# EasyEDA Pro project 大疆分电板（xt60 gh1.25）.epro

# Schematic Schematic1
Board Name: Board1; Create Date: 2024-05-03; Page Name: P1; Project Name: 大疆分电板（can_1.25 xt60）; Schematic Name: Schematic1; Update Date: 2024-05-03; Company: 嘉立创EDA; Page Size: A4; Version: V1.0
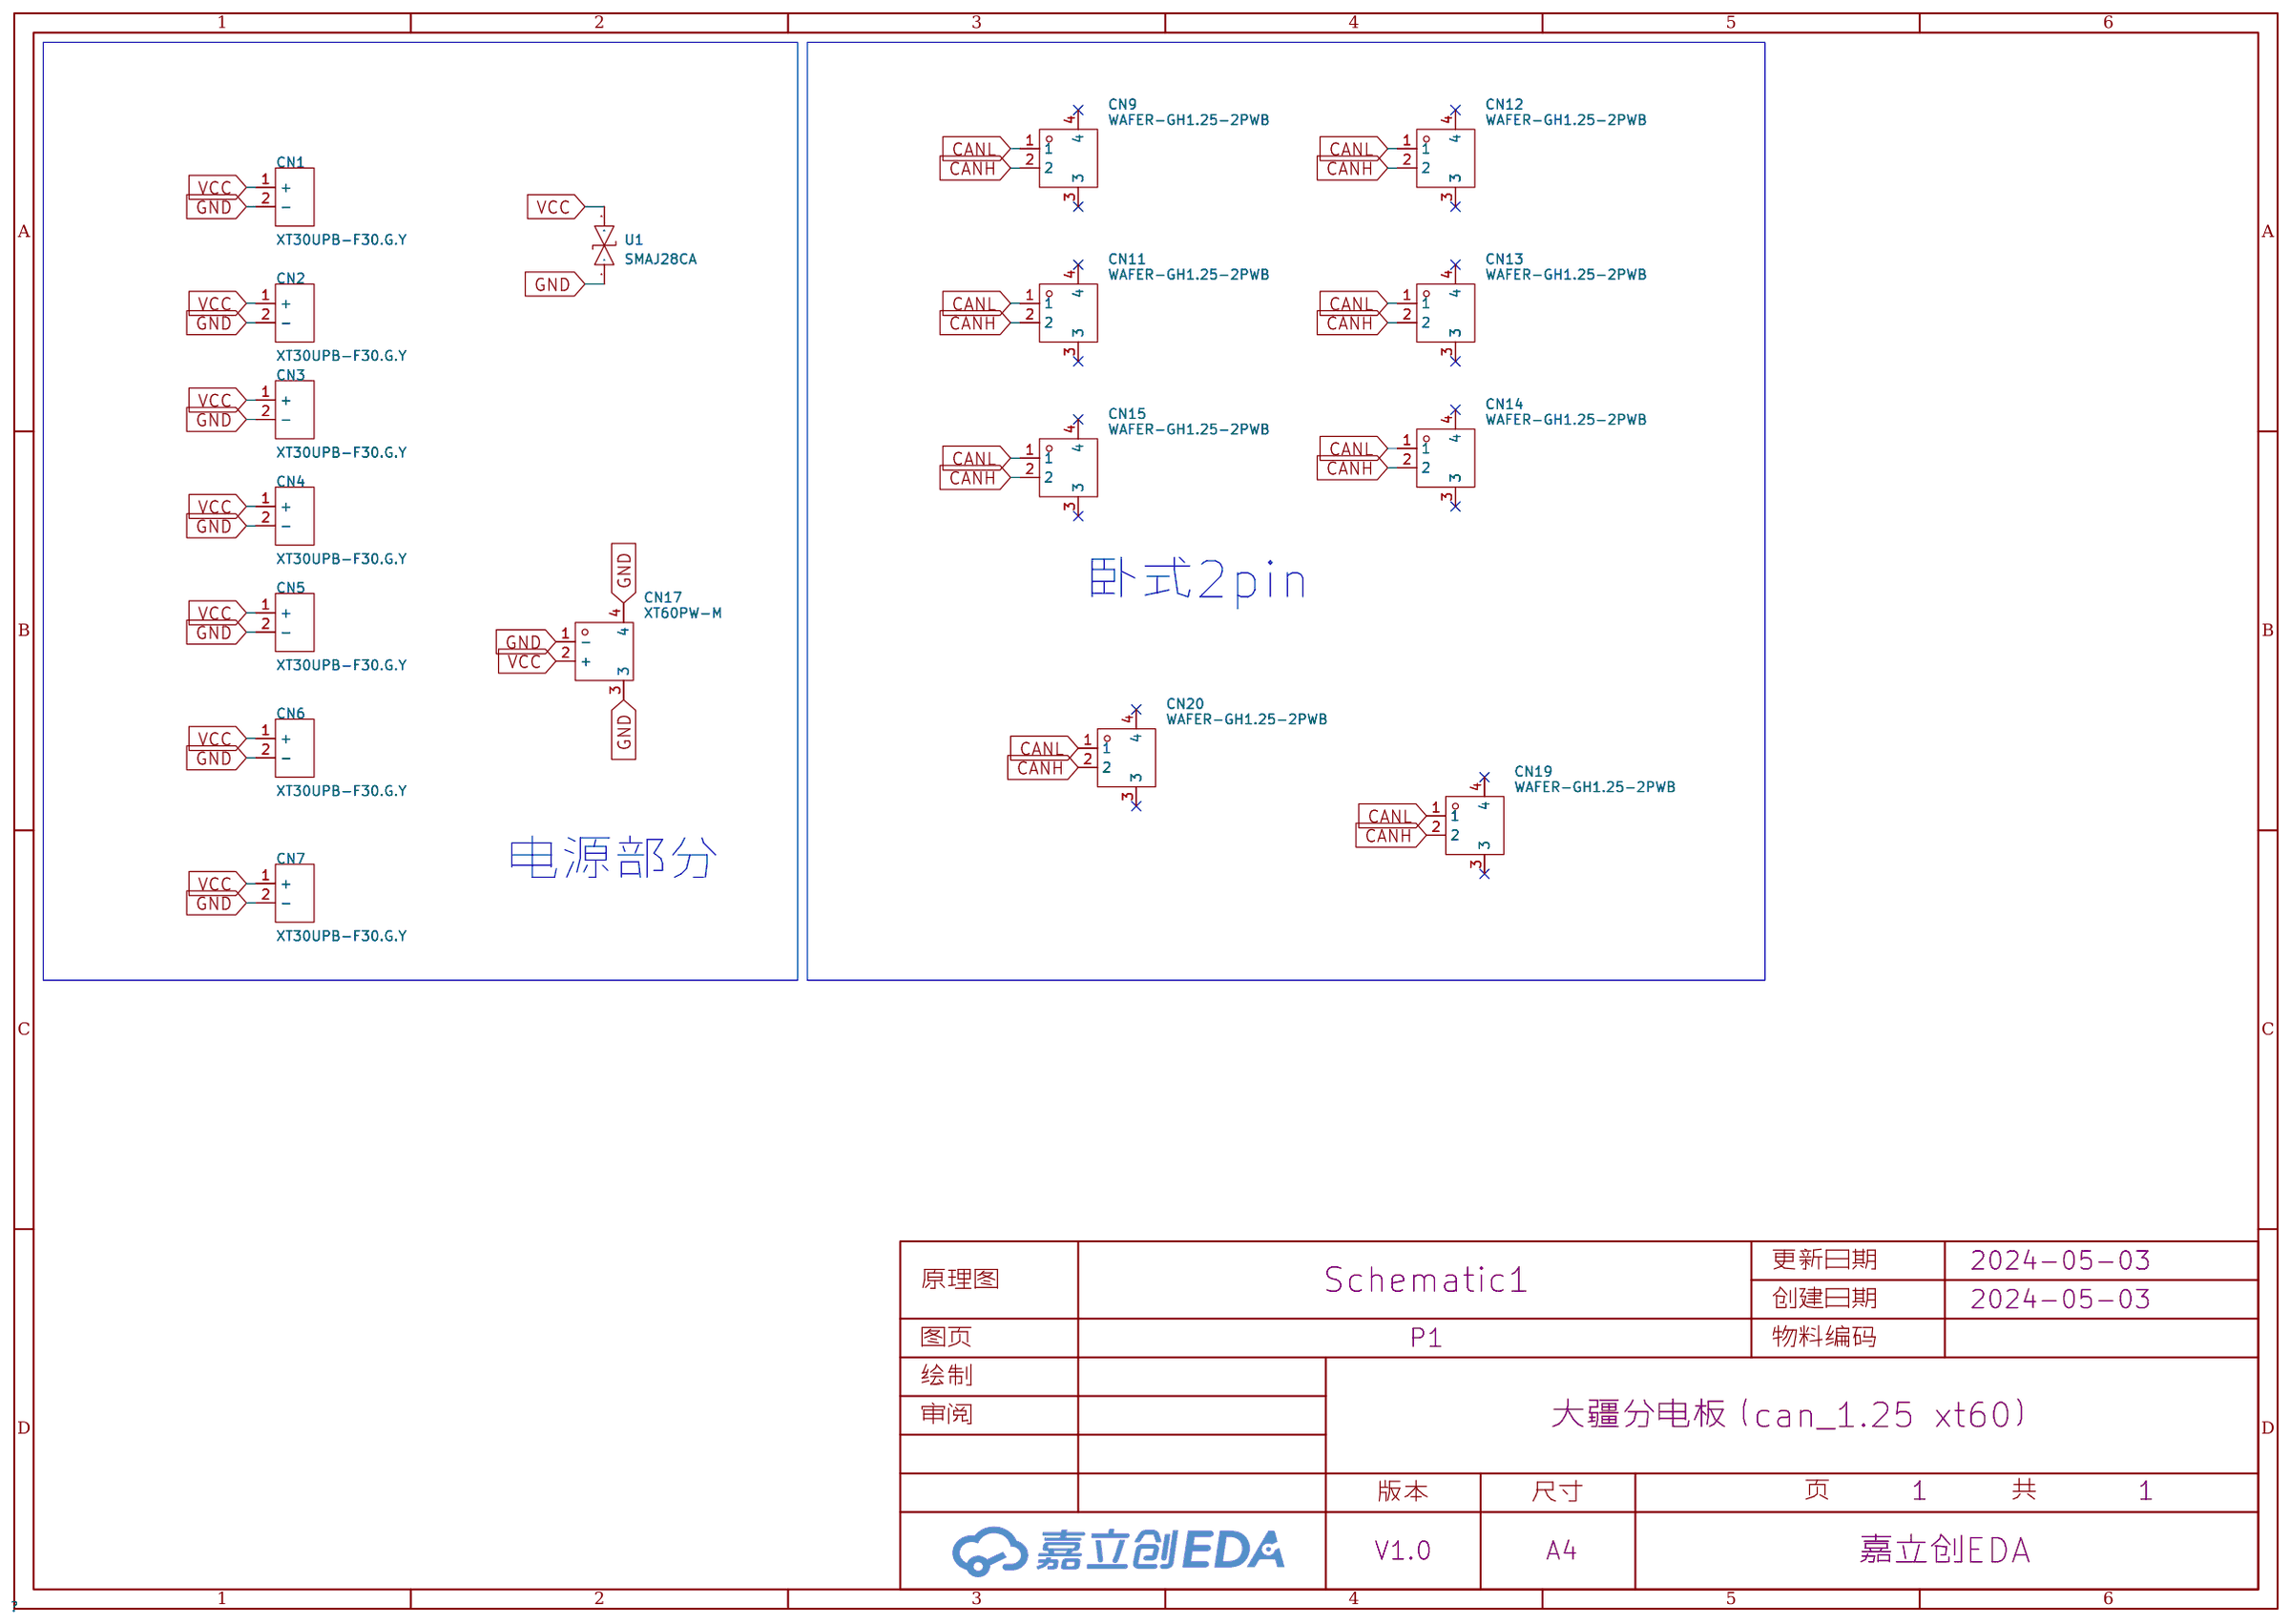
[diagram p0: schematic sheet]

## Parts
CN1  XT30UPB-F30.G.Y  [CONN-TH_XT30UPB-F]
CN2  XT30UPB-F30.G.Y  [CONN-TH_XT30UPB-F]
CN3  XT30UPB-F30.G.Y  [CONN-TH_XT30UPB-F]
CN4  XT30UPB-F30.G.Y  [CONN-TH_XT30UPB-F]
CN5  XT30UPB-F30.G.Y  [CONN-TH_XT30UPB-F]
CN6  XT30UPB-F30.G.Y  [CONN-TH_XT30UPB-F]
CN7  XT30UPB-F30.G.Y  [CONN-TH_XT30UPB-F]
CN9  WAFER-GH1.25-2PWB  [CONN-TH_2P-P1.25_XUNPU_WAFER-GH1.25-2PWB]
CN11  WAFER-GH1.25-2PWB  [CONN-TH_2P-P1.25_XUNPU_WAFER-GH1.25-2PWB]
CN12  WAFER-GH1.25-2PWB  [CONN-TH_2P-P1.25_XUNPU_WAFER-GH1.25-2PWB]
CN13  WAFER-GH1.25-2PWB  [CONN-TH_2P-P1.25_XUNPU_WAFER-GH1.25-2PWB]
CN14  WAFER-GH1.25-2PWB  [CONN-TH_2P-P1.25_XUNPU_WAFER-GH1.25-2PWB]
CN15  WAFER-GH1.25-2PWB  [CONN-TH_2P-P1.25_XUNPU_WAFER-GH1.25-2PWB]
CN17  XT60PW-M  [CONN-TH_XT60PW-M]
CN19  WAFER-GH1.25-2PWB  [CONN-TH_2P-P1.25_XUNPU_WAFER-GH1.25-2PWB]
CN20  WAFER-GH1.25-2PWB  [CONN-TH_2P-P1.25_XUNPU_WAFER-GH1.25-2PWB]
U1  SMAJ28CA  [SMA_L4.3-W2.7-LS5.0-BI]

## Library data of the parts
CN1-CN7 = XT30UPB-F30.G.Y: 类别:-;类型1:-;; LCSC Part Name: AMASS(艾迈斯)直立焊板式连接器XT30UPB30-F.G.*; Supplier Part: C108769; Manufacturer: AMASS(艾迈斯); JLCPCB Part Class: Extended Part; Datasheet: https://atta.szlcsc.com/upload/public/pdf/source/20220715/AFD68B9E8B6CA95A7295DBF4AF9325E4.pdf; Supplier: LCSC; Brand: 艾迈斯; Type: 航模插头; Colour: 黄色; RatedVoltage: DC 500V; InterfaceType: 母头; MetalMaterial: 镀金; InsulationMaterial: PA; RatedCurrent: 15A; contact resistance: 0.65mΩ
CN9 CN11-CN15 CN19 CN20 = WAFER-GH1.25-2PWB: 插针结构:1x2P;间距:1.25mm;安装方式:卧贴;参考系列:GH;总PIN数:2P;排数:1;每排PIN数:2;额定电流:1A;工作温度范围:-25℃~+85℃;; LCSC Part Name: 1x2P 间距:1.25mm 卧贴 系列:GH; Supplier Part: C3029377; Manufacturer: XUNPU(讯普); Supplier Footprint: SMD,P=1.25mm,卧贴; JLCPCB Part Class: Extended Part; Datasheet: https://atta.szlcsc.com/upload/public/pdf/source/20220527/CB8773BFB0913C3B8ABD62CB38BA101A.pdf; Supplier: LCSC; Pins Structure: 1x2P; Pitch: 1.25mm; Mounting Style: 卧贴; Reference Series: GH; Number of Pins: 2P; Number of Rows: 1; Number of PINs Per Row: 2; Current Rating (Max): 1A; Operating Temperature Range: -25℃~+85℃
CN17 = XT60PW-M: 类别:-;类型1:-;; LCSC Part Name: AMASS(艾迈斯)航模插头xt60连接器150公母对接pw锂电池公头 板插卧式XT60PW-M; Supplier Part: C98732; Manufacturer: AMASS(艾迈斯); JLCPCB Part Class: 扩展库; Datasheet: https://atta.szlcsc.com/upload/public/pdf/source/20240118/44A3DCFF53BE25DC65378AFFB21277A4.pdf; Supplier: LCSC; Brand: 艾迈斯; Type: 卧式插头; Colour: 黄色; InterfaceType: 公头
U1 = SMAJ28CA_C908827: 反向截止电压(Vrwm):28V;最大钳位电压:45.4V;峰值脉冲电流(Ipp)@10/1000us:8.8A;击穿电压:31.1V;; LCSC Part Name: 双向TVS 28V截止 8.8A峰值脉冲; Supplier Part: C908827; Manufacturer: GOODWORK(固得沃克); Supplier Footprint: SMA(DO-214AC); JLCPCB Part Class: Extended Part; Datasheet: https://atta.szlcsc.com/upload/public/pdf/source/20201231/C908757_5436EAF671B686EFC2F0DD2098F0ED89.pdf; Supplier: LCSC; Reverse Stand-Off Voltage (Vrwm): 28V; Maximum Clamping Voltage: 45.4V; Peak Pulse Current (Ipp)@10/1000us: 8.8A; Breakdown Voltage: 31.1V; Reverse Leakage Current (Ir): 5uA; Type: TVS

## Nets
GND: CN1.2(-) CN2.2(-) CN3.2(-) CN4.2(-) CN5.2(-) CN6.2(-) CN7.2(-) CN17.1(-) CN17.3 CN17.4 U1.1
VCC: CN1.1(+) CN2.1(+) CN3.1(+) CN4.1(+) CN5.1(+) CN6.1(+) CN7.1(+) CN17.2(+) U1.2
CANH: CN9.2 CN11.2 CN12.2 CN13.2 CN14.2 CN15.2 CN19.2 CN20.2
CANL: CN9.1 CN11.1 CN12.1 CN13.1 CN14.1 CN15.1 CN19.1 CN20.1

Not connected (* = marked no-connect by the designer): CN9 3* 4*; CN11 3* 4*; CN12 3* 4*; CN13 3* 4*; CN14 3* 4*; CN15 3* 4*; CN19 3* 4*; CN20 3* 4*

## Notes on the sheet
- 卧式2pin
- 电源部分

# Board PCB1
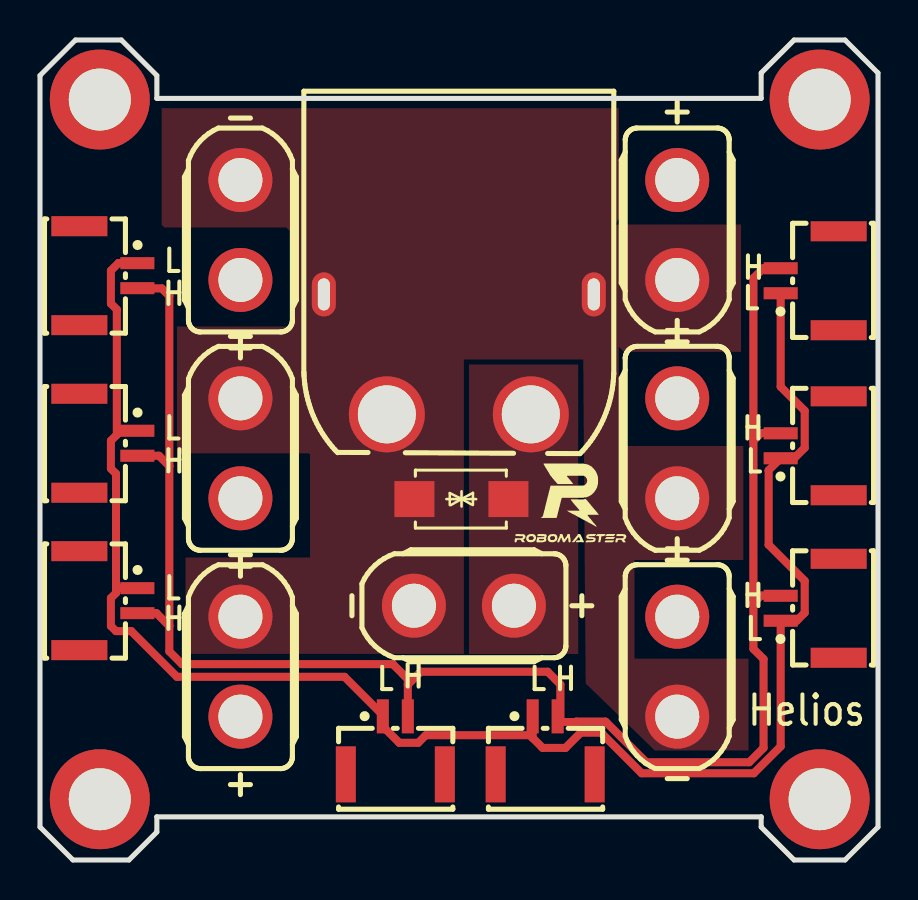
[diagram p1: board, top side]
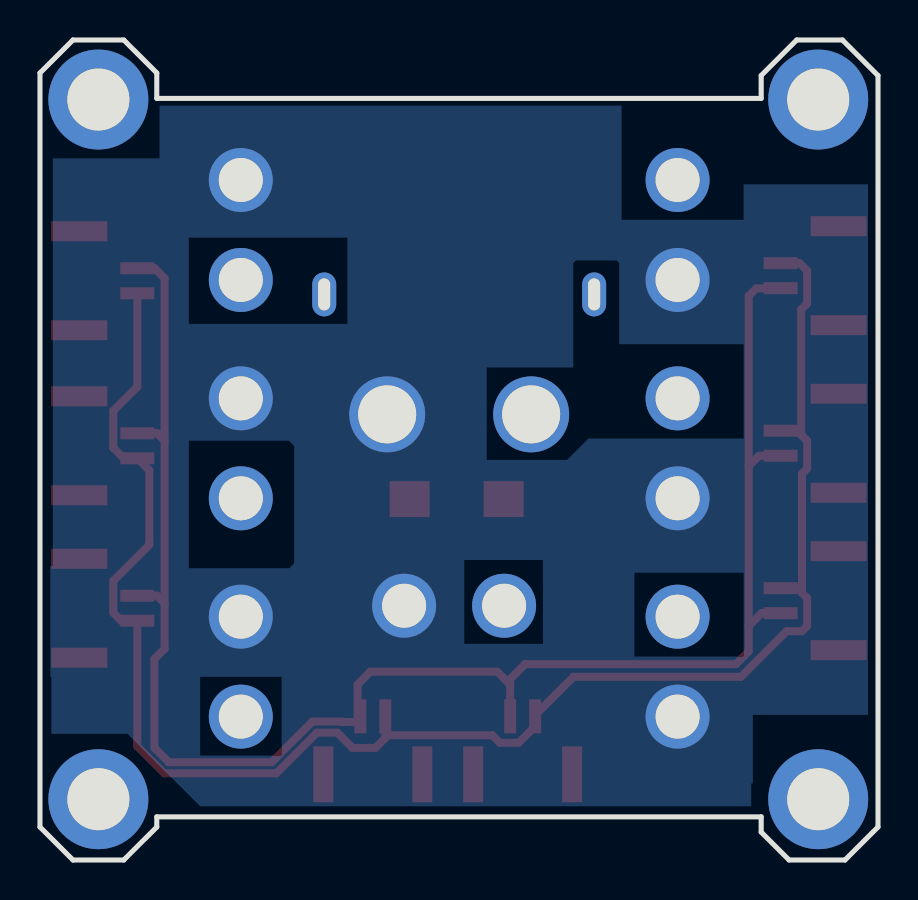
[diagram p2: board, bottom side, seen from below]

Outline 41.91 x 41.02 mm; copper layers: Top Layer, Bottom Layer. Coordinates in mm from the lower left corner of the outline.
Outline path: 0,39.24 1.78,41.02 4.06,41.02 5.84,39.24 5.84,38.1 36.07,38.1 36.07,39.37 37.72,41.02 40.26,41.02 41.91,39.37 41.91,1.65 40.26,0 37.72,0 36.07,1.65 36.07,2.16 5.84,2.16 5.84,1.4 4.45,0 1.65,0 0,1.65 0,39.24
Stack: Top Layer 0.035mm / Dielectric1 1.51mm FR4 er 4.5 / Bottom Layer 0.035mm

## Design rules (mm)
net CANH: DP1
net CANL: DP1
template: JLCPCB Capability(Two Layers Board)
spacing copperThickness1oz (default): track to track 0.102, other pairs 0.152 to 0.3
spacing copperThickness2oz: track to track 0.203, other pairs 0.152 to 0.3
track width copperThickness1oz (default): min 0.127, default 0.254, max 2.54
track width copperThickness2oz: min 0.203, default 0.254, max 2.54
differential pair differentialPair (default): width min 0.127, default 0.254, max 2.54; gap min 0.152, default 0.152
via viaSize (default): diameter min 0.5, default 0.61, max 10; hole min 0.3, default 0.305, max 6.3

## Placement (name value [footprint] x y rotation side)
CN1  XT30UPB-F30.G.Y  [CONN-TH_XT30UPB-F]  10.02 31.52 90 top
CN2  XT30UPB-F30.G.Y  [CONN-TH_XT30UPB-F]  10.02 20.59 90 top
CN3  XT30UPB-F30.G.Y  [CONN-TH_XT30UPB-F]  10.02 9.67 90 top
CN4  XT30UPB-F30.G.Y  [CONN-TH_XT30UPB-F]  31.87 31.52 270 top
CN5  XT30UPB-F30.G.Y  [CONN-TH_XT30UPB-F]  31.87 20.59 270 top
CN6  XT30UPB-F30.G.Y  [CONN-TH_XT30UPB-F]  31.87 9.67 270 top
CN7  XT30UPB-F30.G.Y  [CONN-TH_XT30UPB-F]  21.2 12.72 180 top
CN9  WAFER-GH1.25-2PWB  [CONN-TH_2P-P1.25_XUNPU_WAFER-GH1.25-2PWB]  38.49 28.98 90 top
CN11  WAFER-GH1.25-2PWB  [CONN-TH_2P-P1.25_XUNPU_WAFER-GH1.25-2PWB]  3.42 29.23 270 top
CN12  WAFER-GH1.25-2PWB  [CONN-TH_2P-P1.25_XUNPU_WAFER-GH1.25-2PWB]  38.49 20.72 90 top
CN13  WAFER-GH1.25-2PWB  [CONN-TH_2P-P1.25_XUNPU_WAFER-GH1.25-2PWB]  38.49 12.59 90 top
CN14  WAFER-GH1.25-2PWB  [CONN-TH_2P-P1.25_XUNPU_WAFER-GH1.25-2PWB]  3.42 12.97 270 top
CN15  WAFER-GH1.25-2PWB  [CONN-TH_2P-P1.25_XUNPU_WAFER-GH1.25-2PWB]  3.42 20.85 270 top
CN17  XT60PW-M  [CONN-TH_XT60PW-M]  20.95 25.29 270 top
CN19  WAFER-GH1.25-2PWB  [CONN-TH_2P-P1.25_XUNPU_WAFER-GH1.25-2PWB]  17.77 5.74 0 top
CN20  WAFER-GH1.25-2PWB  [CONN-TH_2P-P1.25_XUNPU_WAFER-GH1.25-2PWB]  25.26 5.74 0 top
NOREF  -  [Pad_e36]  38.99 3.04 0 top
NOREF#2  -  [Pad_e34]  38.99 38.04 0 top
NOREF#3  -  [Pad_e31]  2.99 38.04 0 top
NOREF#4  -  [Pad_e35]  2.99 3.04 0 top
U1  SMAJ28CA  [SMA_L4.3-W2.7-LS5.0-BI]  21.07 18.05 0 top

## Footprints (pads in the part's own frame, mm; a bottom-side part is the same pattern mirrored in y, then rotated)
CONN-TH_2P-P1.25_XUNPU_WAFER-GH1.25-2PWB
  rect 0.6x1.7 smd: 1(-0.625,1.45) 2(0.625,1.45)
  rect 1x2.8 smd: 3(-2.475,-1.45) 4(2.475,-1.45)
CONN-TH_XT30UPB-F
  round 3.2 hole 2.2: 1(-2.5,0) 2(2.5,0)
CONN-TH_XT60PW-M
  round 3.8 hole 2.9: 1(3,-3.6) 2(3,3.6)
  oval 2.2x1.2 hole 1.6x0.6: 3(-3,6.75) 4(-3,-6.75)
Pad_e31
  round 5 hole 3.1: 7(0,0)
Pad_e34
  round 5 hole 3.1: 7(0,0)
Pad_e35
  round 5 hole 3.1: 7(0,0)
Pad_e36
  round 5 hole 3.1: 7(0,0)
SMA_L4.3-W2.7-LS5.0-BI
  rect 2x1.8 smd: 1(-2.35,0) 2(2.35,0)

## Nets
As in the schematic.

Pads without a net: CN9 3 4; CN11 3 4; CN12 3 4; CN13 3 4; CN14 3 4; CN15 3 4; CN19 3 4; CN20 3 4; NOREF 7; NOREF#2 7; NOREF#3 7; NOREF#4 7

## Routing (per net, layer and track width the routed paths; a pad name or vN(x,y) marks a point on that pad's centre or on a via; arc(x,y) is an arc through that point)
CANH: length 87.2
  Top Layer w0.4: 18.4,8.77 19.04,9.42 25.39,9.42 26.03,8.78 26.03,6.91 26.04,6.9 26.79,6.9 26.81,6.92 28.29,6.92 30.32,4.89 35.47,4.89 36.19,5.61 36.19,10.05 35.68,10.56 35.68,12.85 ; 18.4,8.77 18.4,9.05 17.64,9.8 7.1,9.8 6.47,10.43 6.47,11.7 ; 18.4,8.77 18.4,7.28 ; 35.68,12.85 35.68,20.98 ; 35.68,12.85 36.06,13.23 37.03,13.23 CN13.2 ; 35.68,20.98 35.68,29.1 36.19,29.61 37.03,29.61 CN9.2 ; 35.68,20.98 36.06,21.36 37.03,21.36 CN12.2 ; 6.47,19.71 5.95,20.22 CN15.2 ; 6.47,19.71 6.47,11.7 ; 6.47,19.71 6.47,28.21 6.09,28.6 4.88,28.6 CN11.2 ; 6.47,11.7 5.82,12.35 CN14.2
CANL: length 87.4
  Top Layer w0.4: 3.8,13.61 3.8,13.36 3.55,13.1 3.55,11.7 3.8,11.45 4.56,11.45 6.85,9.16 15.23,9.16 17.15,7.25 17.15,6.68 17.97,5.86 18.91,5.86 19.29,6.24 24.5,6.24 24.64,6.11 ; 3.8,13.61 3.8,19.32 3.55,19.58 3.55,20.98 3.84,21.27 ; 3.8,13.61 3.81,13.6 CN14.1 ; CN20.1 24.64,6.11 ; 24.64,6.11 25.14,5.61 26.28,5.61 27.04,6.37 28.06,6.37 30.09,4.34 35.7,4.34 37.04,5.68 CN13.1 37.84,11.97 38.24,12.37 38.24,13.96 36.44,15.77 36.44,19.49 CN12.1 37.72,20.1 38.24,20.62 38.24,22.47 37.04,23.67 CN9.1 ; 3.84,21.27 4.04,21.47 CN15.1 ; 3.84,21.27 3.84,27.54 3.55,27.83 3.55,29.48 3.93,29.87 4.86,29.87 CN11.1

## Copper pours and planes (outline as drawn; the poured copper is in the pictures)
GND on Top Layer: 6.09,37.61 35.43,37.61 35.43,5.48 6.09,5.48
VCC on Top Layer: 21.45,24.79 26.91,24.79 26.91,10.31 21.45,10.31
VCC on Bottom Layer: 34.47,35.1 41.27,35.1 41.27,12.97 34.47,12.97
VCC on Bottom Layer: 6.34,10.82 41.34,10.82 41.34,2.69 6.34,2.69
VCC on Bottom Layer: 0.66,37.74 41.39,37.74 41.39,3.83 0.66,3.83
VCC on Bottom Layer: 0.5,33.8 6.72,33.8 6.72,7.26 0.5,7.26

## Text on the board
Top Silkscreen Layer: H | L | Helios
